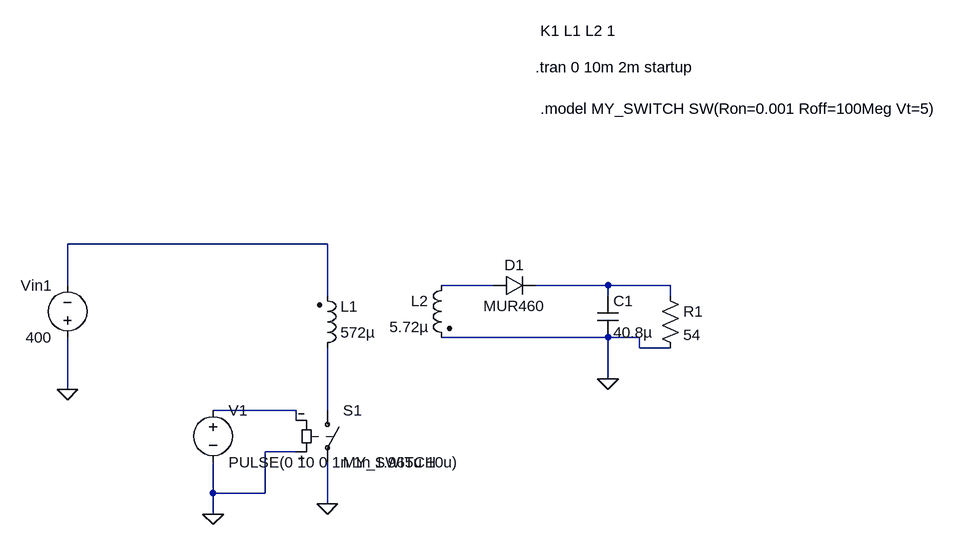
[diagram p0: schematic Draft4.asc]
Draft4.asc, the LTspice schematic file:
Version 4
SHEET 1 1084 916
WIRE 96 176 -304 176
WIRE -304 240 -304 176
WIRE 352 240 272 240
WIRE 528 240 416 240
WIRE 624 240 528 240
WIRE 96 256 96 176
WIRE 528 256 528 240
WIRE 624 256 624 240
WIRE 528 320 272 320
WIRE 576 320 528 320
WIRE 576 336 576 320
WIRE 624 336 576 336
WIRE 528 384 528 320
WIRE -304 400 -304 320
WIRE 48 432 -80 432
WIRE 96 432 96 336
WIRE 48 448 48 432
WIRE 48 496 0 496
WIRE -80 560 -80 512
WIRE 0 560 0 496
WIRE 0 560 -80 560
WIRE 96 576 96 512
WIRE -80 592 -80 560
FLAG 528 384 0
FLAG 96 576 0
FLAG -80 592 0
FLAG -304 400 0
SYMBOL ind2 80 352 M180
WINDOW 0 36 80 Left 2
WINDOW 3 36 40 Left 2
SYMATTR InstName L1
SYMATTR Value 572µ
SYMATTR Type ind
SYMBOL ind2 288 224 M0
SYMATTR InstName L2
SYMATTR Value 5.72µ
SYMATTR Type ind
SYMBOL diode 352 256 R270
WINDOW 0 32 32 VTop 2
WINDOW 3 0 32 VBottom 2
SYMATTR InstName D1
SYMATTR Value MUR460
SYMBOL cap 512 256 R0
SYMATTR InstName C1
SYMATTR Value 40.8µ
SYMBOL voltage -304 336 R180
WINDOW 0 24 96 Left 2
WINDOW 3 24 16 Left 2
WINDOW 123 0 0 Left 0
WINDOW 39 0 0 Left 0
SYMATTR InstName Vin1
SYMATTR Value 400
SYMBOL res 608 240 R0
SYMATTR InstName R1
SYMATTR Value 54
SYMBOL sw 96 416 R0
SYMATTR InstName S1
SYMATTR Value MY_SWITCH
SYMBOL voltage -80 416 R0
SYMATTR InstName V1
SYMATTR Value PULSE(0 10 0 1n 1n 1.965u 10u)
TEXT 424 -152 Left 2 !K1 L1 L2 1
TEXT 416 -96 Left 2 !.tran 0 10m 2m startup
TEXT 424 -32 Left 2 !.model MY_SWITCH SW(Ron=0.001 Roff=100Meg Vt=5)

The netlist it stands for:
* Draft4.asc
L1 N005 N001 572µ
L2 N002 0 5.72µ
D1 N002 N003 MUR460
C1 N003 0 40.8µ
Vin1 0 N001 400
R1 N003 0 54
S1 N005 0 0 N004 MY_SWITCH
V1 N004 0 PULSE(0 10 0 1n 1n 1.965u 10u)
.model D D
.lib standard.dio
K1 L1 L2 1
.tran 0 10m 2m startup
.model MY_SWITCH SW(Ron=0.001 Roff=100Meg Vt=5)
.backanno
.end